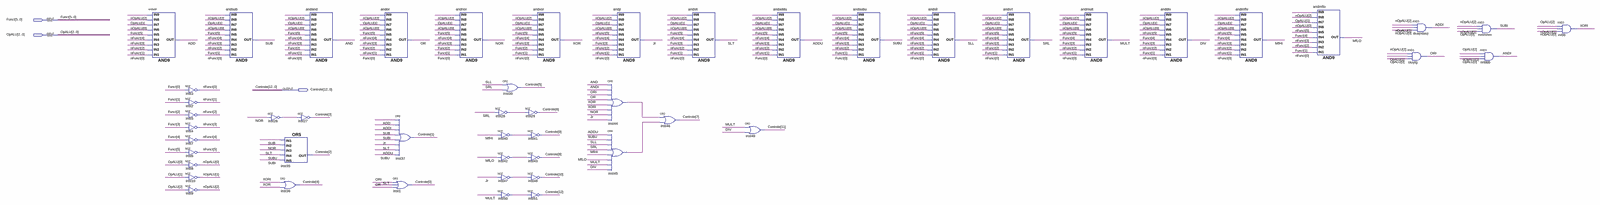
[diagram p0: schematic sheet, whole]
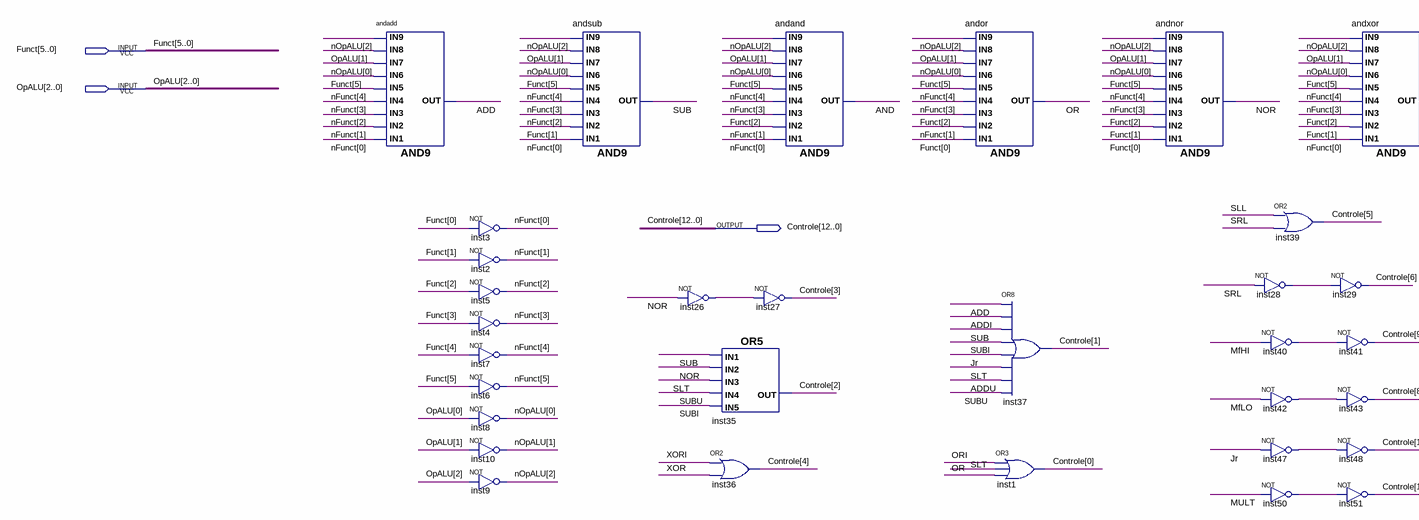
[diagram p1: schematic sheet, left part]
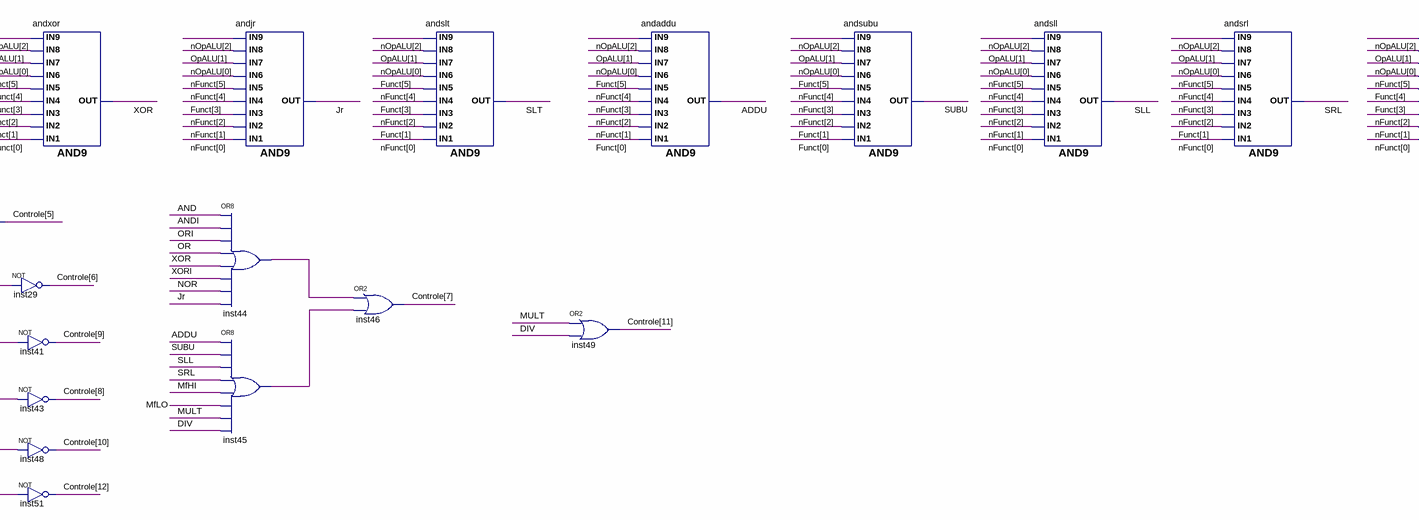
[diagram p2: schematic sheet, centre part]
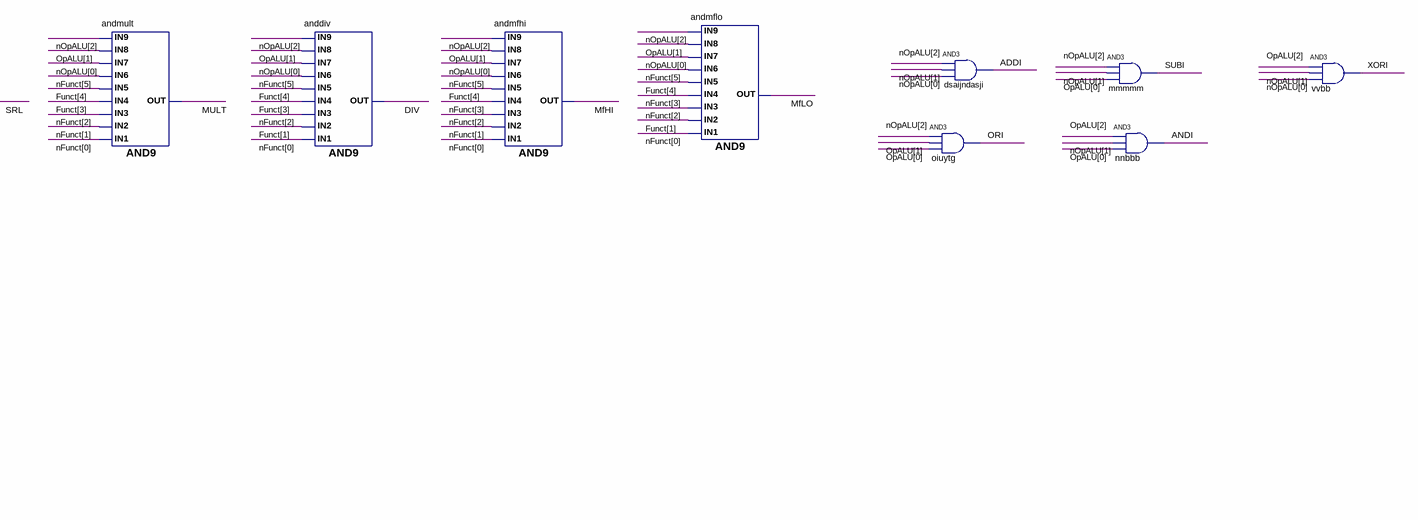
[diagram p3: schematic sheet, right part]
// Quartus schematic ControleULA.bdf as structural Verilog: 51 symbols, 3 pins
module ControleULA (
  input  [5:0] Funct,
  input  [2:0] OpALU,
  output [12:0] Controle
);

  wire ADD, ADDI, ADDU, AND, ANDI, DIV, inst26_out, inst28_out, inst40_out, inst42_out, inst44_out,
       inst45_out, inst47_out, inst50_out, Jr, MfHI, MfLO, MULT, NOR, OR, ORI, SLL, SLT, SRL, SUB, SUBI,
       SUBU, XOR, XORI;
  wire [2:0] nOpALU;
  wire [5:0] nFunct;

  and andadd (ADD, nFunct[0], nFunct[1], nFunct[2], nFunct[3], nFunct[4], Funct[5], nOpALU[0], OpALU[1], nOpALU[2]);
  not inst3 (nFunct[0], Funct[0]);
  not inst2 (nFunct[1], Funct[1]);
  not inst5 (nFunct[2], Funct[2]);
  not inst4 (nFunct[3], Funct[3]);
  not inst7 (nFunct[4], Funct[4]);
  not inst6 (nFunct[5], Funct[5]);
  not inst8 (nOpALU[0], OpALU[0]);
  not inst10 (nOpALU[1], OpALU[1]);
  not inst9 (nOpALU[2], OpALU[2]);
  and andsub (SUB, nFunct[0], Funct[1], nFunct[2], nFunct[3], nFunct[4], Funct[5], nOpALU[0], OpALU[1], nOpALU[2]);
  not inst26 (inst26_out, NOR);
  or inst35 (Controle[2], SUB, NOR, SLT, SUBU, SUBI);
  or inst36 (Controle[4], XORI, XOR);
  and andand (AND, nFunct[0], nFunct[1], Funct[2], nFunct[3], nFunct[4], Funct[5], nOpALU[0], OpALU[1], nOpALU[2]);
  not inst27 (Controle[3], inst26_out);
  and andor (OR, Funct[0], nFunct[1], Funct[2], nFunct[3], nFunct[4], Funct[5], nOpALU[0], OpALU[1], nOpALU[2]);
  or inst37 (Controle[1], ADD, ADDI, SUB, SUBI, Jr, SLT, ADDU, SUBU);
  or inst1 (Controle[0], ORI, SLT, OR);
  and andnor (NOR, Funct[0], Funct[1], Funct[2], nFunct[3], nFunct[4], Funct[5], nOpALU[0], OpALU[1], nOpALU[2]);
  or inst39 (Controle[5], SLL, SRL);
  not inst28 (inst28_out, SRL);
  not inst40 (inst40_out, MfHI);
  not inst42 (inst42_out, MfLO);
  not inst47 (inst47_out, Jr);
  not inst50 (inst50_out, MULT);
  not inst29 (Controle[6], inst28_out);
  and andxor (XOR, nFunct[0], Funct[1], Funct[2], nFunct[3], nFunct[4], Funct[5], nOpALU[0], OpALU[1], nOpALU[2]);
  not inst41 (Controle[9], inst40_out);
  not inst43 (Controle[8], inst42_out);
  not inst48 (Controle[10], inst47_out);
  not inst51 (Controle[12], inst50_out);
  and andjr (Jr, nFunct[0], nFunct[1], nFunct[2], Funct[3], nFunct[4], nFunct[5], nOpALU[0], OpALU[1], nOpALU[2]);
  or inst44 (inst44_out, AND, ANDI, ORI, OR, XOR, XORI, NOR, Jr);
  or inst45 (inst45_out, ADDU, SUBU, SLL, SRL, MfHI, MfLO, MULT, DIV);
  or inst46 (Controle[7], inst44_out, inst45_out);
  and andslt (SLT, nFunct[0], Funct[1], nFunct[2], Funct[3], nFunct[4], Funct[5], nOpALU[0], OpALU[1], nOpALU[2]);
  or inst49 (Controle[11], MULT, DIV);
  and andaddu (ADDU, Funct[0], nFunct[1], nFunct[2], nFunct[3], nFunct[4], Funct[5], nOpALU[0], OpALU[1], nOpALU[2]);
  and andsubu (SUBU, Funct[0], Funct[1], nFunct[2], nFunct[3], nFunct[4], Funct[5], nOpALU[0], OpALU[1], nOpALU[2]);
  and andsll (SLL, nFunct[0], nFunct[1], nFunct[2], nFunct[3], nFunct[4], nFunct[5], nOpALU[0], OpALU[1], nOpALU[2]);
  and andsrl (SRL, nFunct[0], Funct[1], nFunct[2], nFunct[3], nFunct[4], nFunct[5], nOpALU[0], OpALU[1], nOpALU[2]);
  and andmult (MULT, nFunct[0], nFunct[1], nFunct[2], Funct[3], Funct[4], nFunct[5], nOpALU[0], OpALU[1], nOpALU[2]);
  and anddiv (DIV, nFunct[0], Funct[1], nFunct[2], Funct[3], Funct[4], nFunct[5], nOpALU[0], OpALU[1], nOpALU[2]);
  and andmfhi (MfHI, nFunct[0], nFunct[1], nFunct[2], nFunct[3], Funct[4], nFunct[5], nOpALU[0], OpALU[1], nOpALU[2]);
  and andmflo (MfLO, nFunct[0], Funct[1], nFunct[2], nFunct[3], Funct[4], nFunct[5], nOpALU[0], OpALU[1], nOpALU[2]);
  and dsaijndasji (ADDI, nOpALU[2], nOpALU[1], nOpALU[0]);
  and oiuytg (ORI, nOpALU[2], OpALU[1], OpALU[0]);
  and mmmmm (SUBI, nOpALU[2], nOpALU[1], OpALU[0]);
  and nnbbb (ANDI, OpALU[2], nOpALU[1], OpALU[0]);
  and vvbb (XORI, OpALU[2], nOpALU[1], nOpALU[0]);
endmodule
